# EAGLE design lamp (EAGLE 4.16)
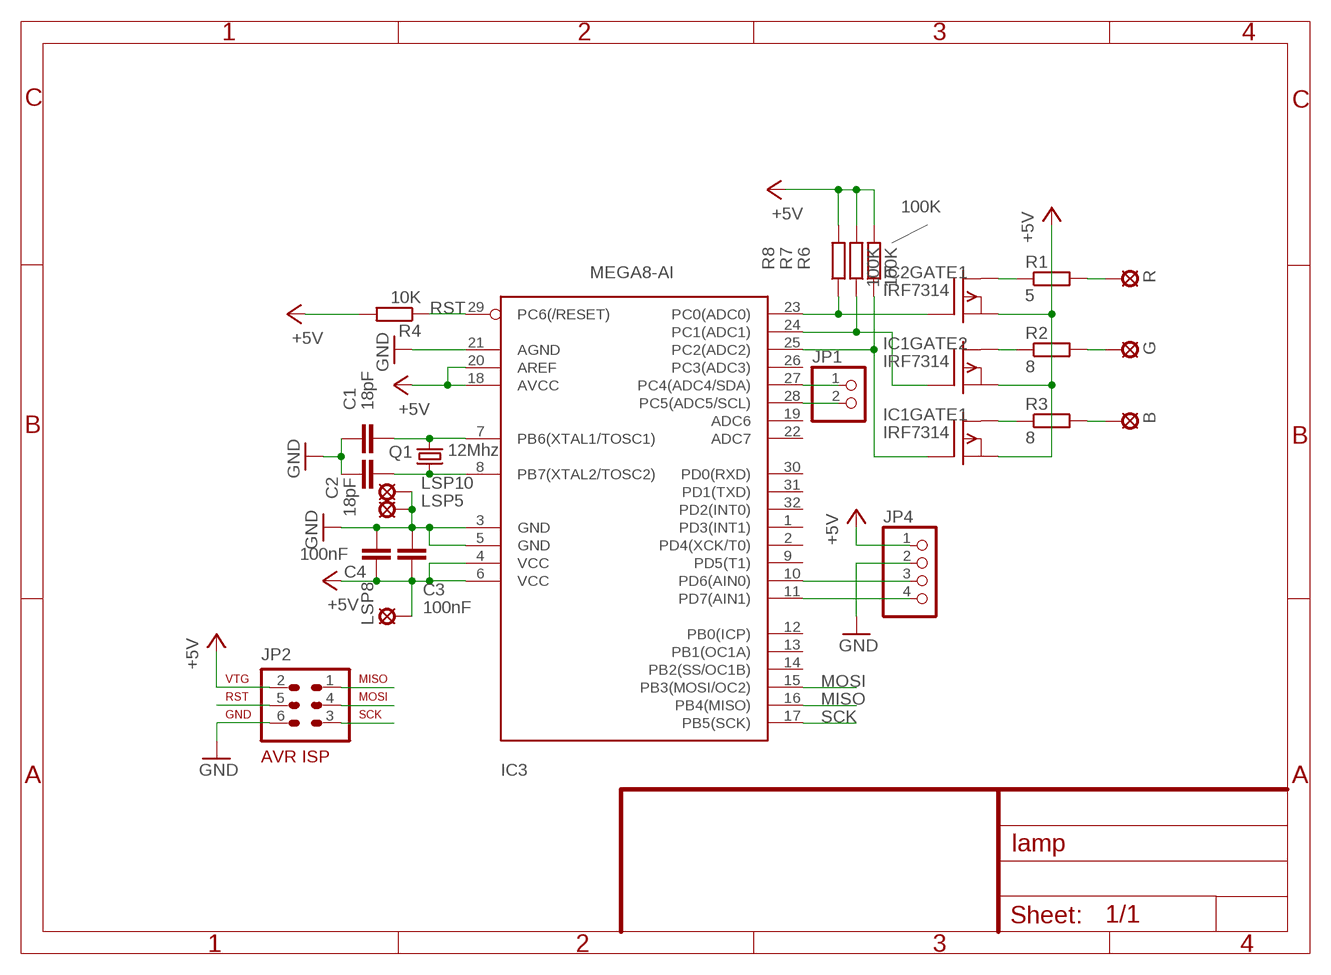
[diagram p0: schematic, sheet 1]

## Parts
B  SE14  [SE14]
C1  18pF  C-EUC0805K  [C0805K]
C2  18pF  C-EUC0805K  [C0805K]
C3  100nF  C-EUC0805K  [C0805K]
C4  100nF  C-EUC0805K  [C0805K]
G  SE14  [SE14]
IC1  IRF7314  IRF7341  [SO-8]
IC2  IRF7314  IRF7341  [SO-8]
IC3  MEGA8-AI  [TQFP32-08]
JP1  PINHD-1X2  [1X02]
JP2  AVR-ISP-6  [AVR-ISP-6]
JP4  PINHD-1X4  [1X04]
LSP5  SE14  [SE14]
LSP8  SE14  [SE14]
LSP10  SE14  [SE14]
Q1  12Mhz  CRYTALHC49S  [HC49/S]
R  SE14  [SE14]
R1  5  R-EU_0207/10  [0207/10]
R2  8  R-EU_0207/10  [0207/10]
R3  8  R-EU_0207/10  [0207/10]
R4  10K  R-EU_M0805  [M0805]
R6  100K  R-EU_M0805  [M0805]
R7  100K  R-EU_M0805  [M0805]
R8  100K  R-EU_M0805  [M0805]

## Nets
+5V: C3.1 C4.1 IC1.1(GATE1:S) IC1.3(GATE2:S) IC2.1(GATE1:S) IC3.4(VCC) IC3.6(VCC) IC3.18(AVCC) IC3.20(AREF) JP2.2 JP4.1 LSP8.MP R4.2 R6.2 R7.2 R8.2
GND: C1.1 C2.1 C3.2 C4.2 IC3.3(GND) IC3.5(GND) IC3.21(AGND) JP2.6 JP4.2 LSP5.MP LSP10.MP
MISO: IC3.16(PB4(MISO)) JP2.1
MOSI: IC3.15(PB3(MOSI/OC2)) JP2.4
N$1: IC1.7(GATE1:D1) R3.1
N$2: IC1.4(GATE2:G) IC3.24(PC1(ADC1)) R7.1
N$3: IC1.2(GATE1:G) IC3.25(PC2(ADC2)) R6.1
N$4: IC1.5(GATE2:D1) R2.1
N$5: IC2.7(GATE1:D1) R1.1
N$6: IC2.2(GATE1:G) IC3.23(PC0(ADC0)) R8.1
N$7: B.MP R3.2
N$8: G.MP R2.2
N$9: R1.2 R.MP
N$10: IC3.27(PC4(ADC4/SDA)) JP1.1
N$11: IC3.10(PD6(AIN0)) JP4.3
N$12: IC3.11(PD7(AIN1)) JP4.4
N$13: IC3.28(PC5(ADC5/SCL)) JP1.2
RST: IC3.29(PC6(/RESET)) JP2.5 R4.1
SCK: IC3.17(PB5(SCK)) JP2.3
XTAL1: C1.2 IC3.7(PB6(XTAL1/TOSC1)) Q1.2
XTAL2: C2.2 IC3.8(PB7(XTAL2/TOSC2)) Q1.1
Unconnected: IC1.6(GATE2:D) IC1.8(GATE1:D) IC2.3(GATE2:S) IC2.4(GATE2:G) IC2.5(GATE2:D1) IC2.6(GATE2:D) IC2.8(GATE1:D) IC3.1(PD3(INT1)) IC3.2(PD4(XCK/T0)) IC3.9(PD5(T1)) IC3.12(PB0(ICP)) IC3.13(PB1(OC1A)) IC3.14(PB2(SS/OC1B)) IC3.19(ADC6) IC3.22(ADC7) IC3.26(PC3(ADC3)) IC3.30(PD0(RXD)) IC3.31(PD1(TXD)) IC3.32(PD2(INT0))

## Library data of the parts
B G LSP5 LSP8 LSP10 R = solpad:SE14: SOLDER PAD E1553, drill 1,4mm, distributor Buerklin, 07F820
C1-C4 = rcl:C-EU: CAPACITOR, European symbol
IC1 IC2 = transistor-fet:IRF7341
IC3 = avr:MEGA8: MICROCONTROLLER 8 Kbytes FLASH 1 kbytes SRAM 512 bytes EEPROM USART 6-channel 10 bit ADC 2-channel 8 bit ADC
JP1 = pinhead:PINHD-1X2: PIN HEADER
JP2 = atmel:AVR-ISP-6: AVR ISP-6 Serial Programming Header
JP4 = pinhead:PINHD-1X4: PIN HEADER
Q1 = crystal:CRYTAL: CRYSTAL
R1-R4 R6-R8 = rcl:R-EU_: RESISTOR, European symbol

## Board
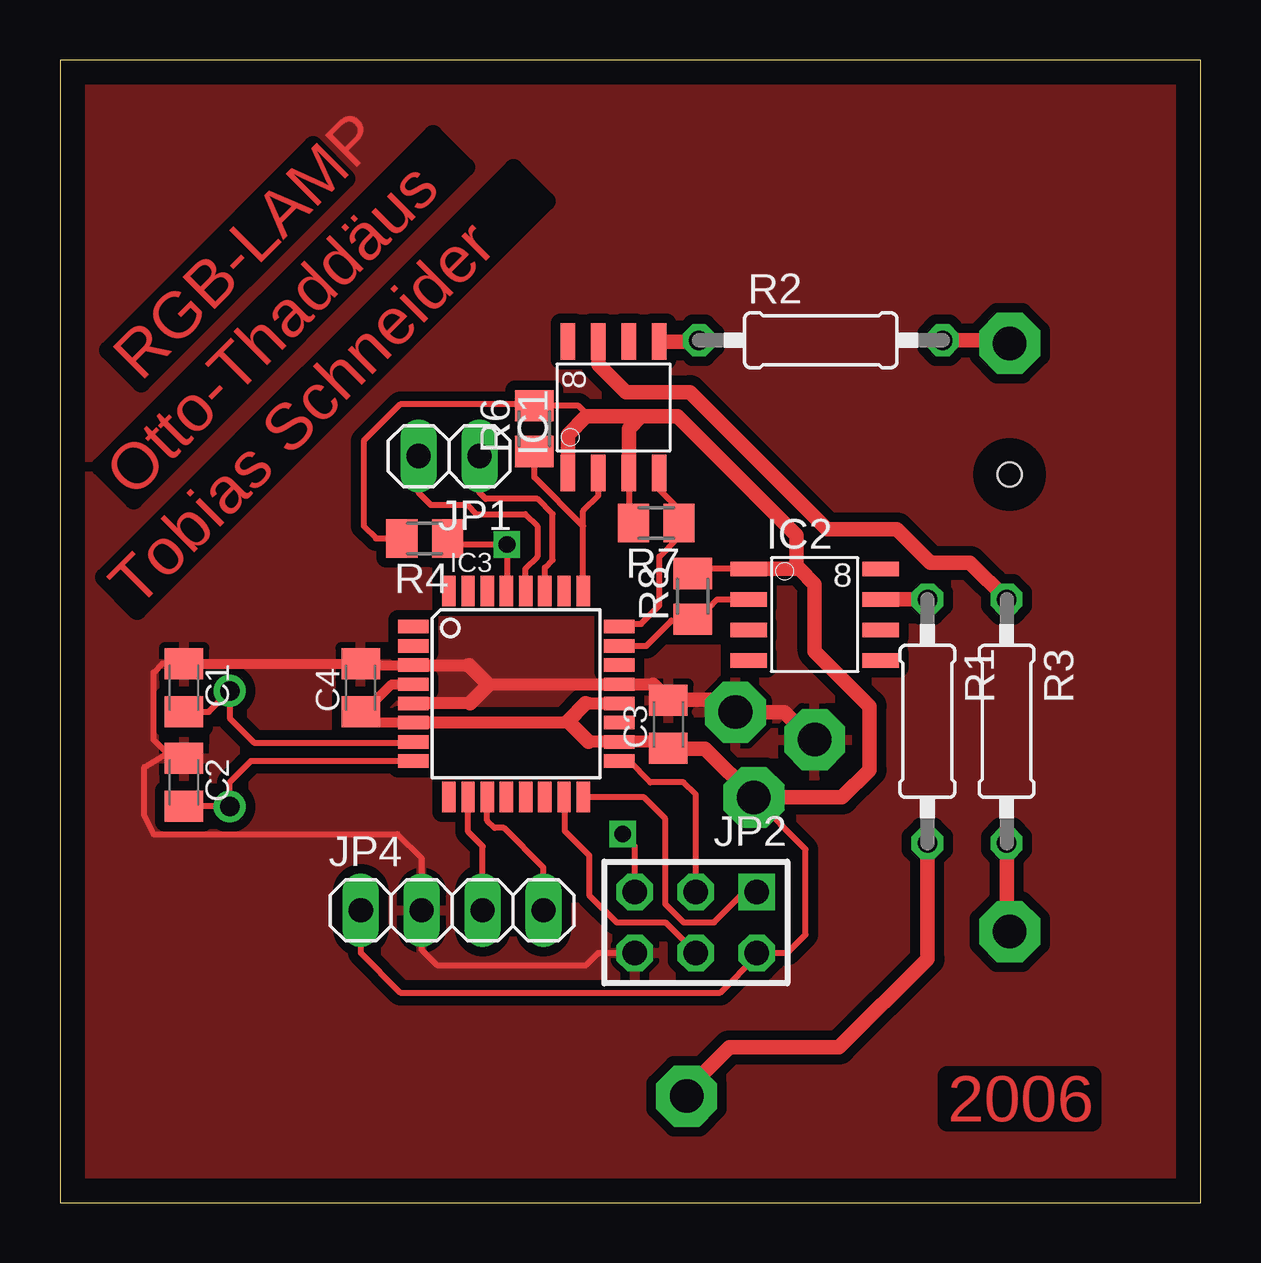
[diagram p1: board, top side]
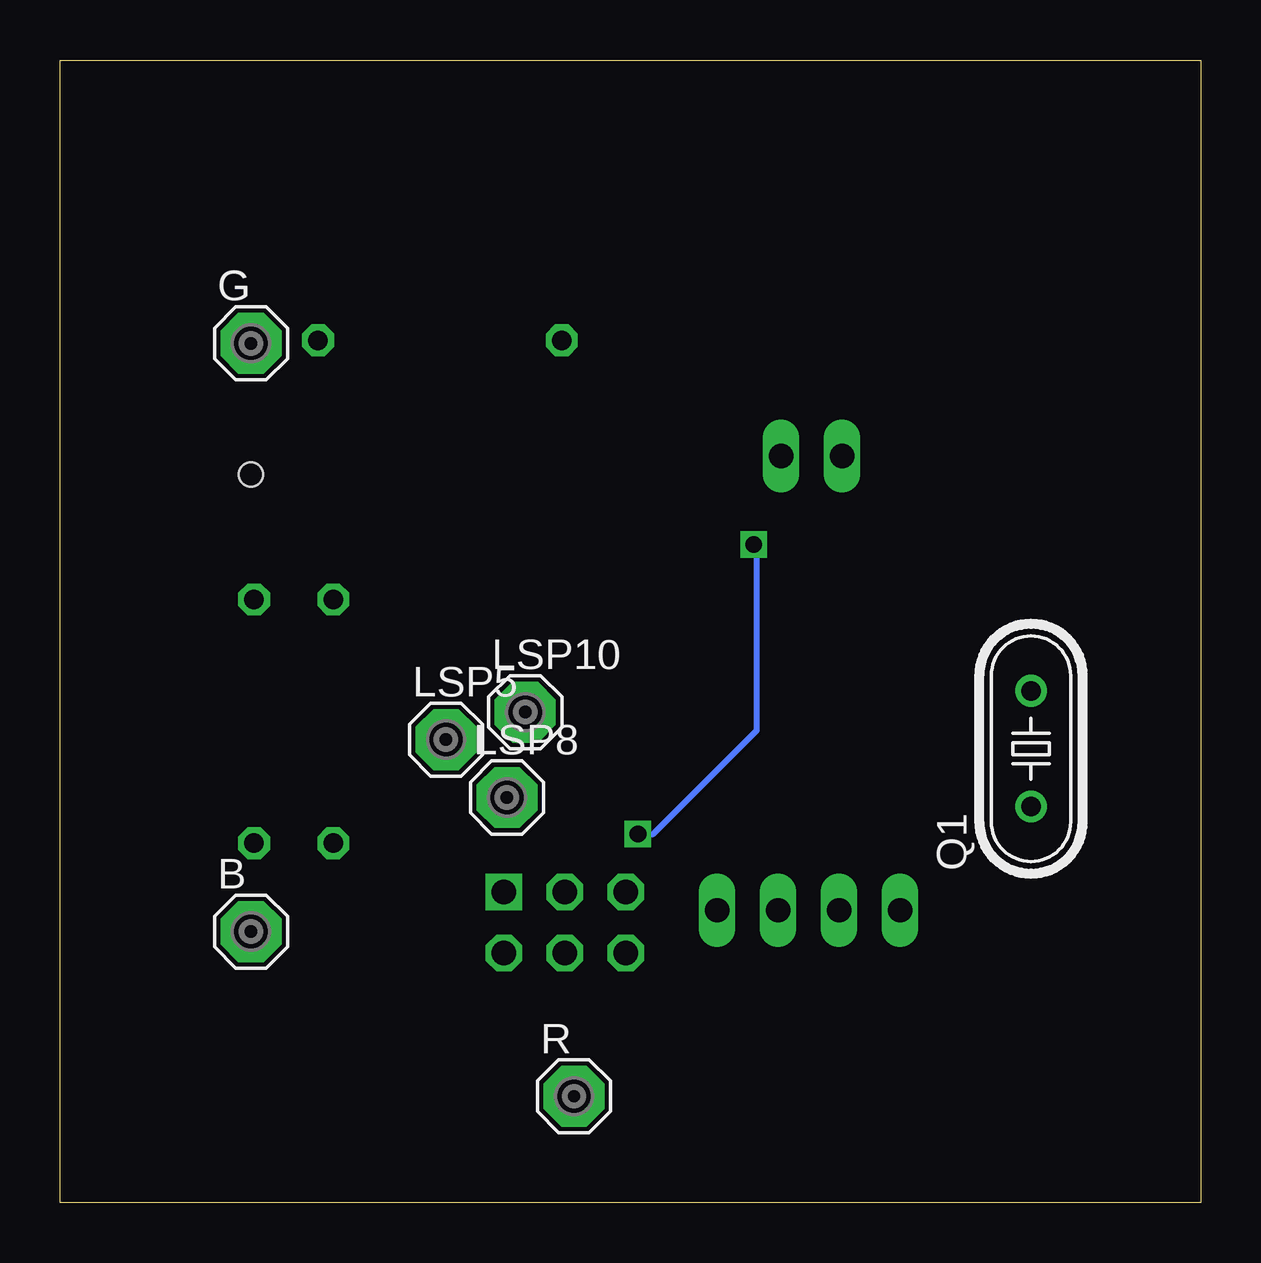
[diagram p2: board, bottom side, seen from below]

Size 47.55 x 47.62 mm. Coordinates in mm from the lower left corner, seen from the top.
Outline: 0,0 47.55,0 47.55,47.62 0,47.62 0,0
Copper layers (1*16): Top 0.035mm / dielectric 1.5mm / Bottom 0.035mm
Design rules "default": minimum track width 6mil, minimum drill 0.5mm, track to track 8mil, track to pad 8mil, pad to pad 8mil, via to via 8mil, smd to smd 8mil, copper to edge 40mil, drill to drill 8mil, minimum pad ring 10mil, minimum via ring 8mil, stop-mask expansion 4mil, vias tented up to drill 0mil, thermal gap 10mil
Holes 1 mm at 39.59,30.35

### Footprints (pad centres in the part's own frame; a part is rotated, then mirrored left to right if it is on the bottom)
SE14 = drill 1.397 pad 2.54 octagon: MP 0,0
C0805K = smd 1.3 x 1.6: 1 -1,0; 2 1,0
SO-8 = smd 1.524 x 0.61: 1 -2.743,1.27; 2 -2.743,0; 3 -2.743,-1.27; 4 -2.743,-2.54; 5 2.743,-2.54; 6 2.743,-1.27; 7 2.743,0; 8 2.743,1.27
TQFP32-08 = smd 1.27 x 0.559: 1 -4.293,2.8; 2 -4.293,2; 3 -4.293,1.2; 4 -4.293,0.4; 5 -4.293,-0.4; 6 -4.293,-1.2; 7 -4.293,-2; 8 -4.293,-2.8; 17 4.293,-2.8; 18 4.293,-2; 19 4.293,-1.2; 20 4.293,-0.4; 21 4.293,0.4; 22 4.293,1.2; 23 4.293,2; 24 4.293,2.8 | smd 0.559 x 1.27: 9 -2.8,-4.293; 10 -2,-4.293; 11 -1.2,-4.293; 12 -0.4,-4.293; 13 0.4,-4.293; 14 1.2,-4.293; 15 2,-4.293; 16 2.8,-4.293; 25 2.8,4.293; 26 2,4.293; 27 1.2,4.293; 28 0.4,4.293; 29 -0.4,4.293; 30 -1.2,4.293; 31 -2,4.293; 32 -2.8,4.293
1X02 = drill 1.016 long: 1 -1.27,0; 2 1.27,0
AVR-ISP-6 = drill 1.016 square: 1 -2.54,-1.27 | drill 1.016 octagon: 2 -2.54,1.27; 3 0,-1.27; 4 0,1.27; 5 2.54,-1.27; 6 2.54,1.27
1X04 = drill 1.016 long: 1 -3.81,0; 2 -1.27,0; 3 1.27,0; 4 3.81,0
HC49/S = drill 0.813 round: 1 -2.413,0; 2 2.413,0
0207/10 = drill 0.813 octagon: 1 -5.08,0; 2 5.08,0
M0805 = smd 1.3 x 1.6: 1 -0.95,0; 2 0.95,0

### Placement (x,y rotation side)
B  39.59,11.3 0 bottom
C1  5.17,21.46 270 top
C2  5.17,17.52 270 top
C3  25.36,19.93 90 top
C4  12.54,21.46 90 top
G  39.59,35.81 0 bottom
IC1  22.44,33.14 90 top
IC2  31.46,25.14 0 top
IC3  19.01,21.2 0 top
JP1  16.22,31.11 180 top
JP2  26.5,11.68 180 top
JP4  16.34,12.19 0 top
LSP5  31.46,19.3 0 bottom
LSP8  28.92,16.89 0 bottom
LSP10  28.16,20.44 0 bottom
Q1  7.07,18.92 90 bottom
R  26.12,4.44 0 bottom
R1  36.16,20.06 270 top
R2  31.71,35.94 0 top
R3  39.46,20.06 270 top
R4  15.2,27.68 180 top
R6  19.77,32.25 90 top
R7  24.85,28.32 180 top
R8  26.38,25.27 90 top

### Tracks (layer width: path | path; a pad name or v marks a point on that pad's centre or on a via)
+5V
  Top 0.254: 23.9,28.19 23.96,28.19 | 23.9,28.19 R7.2 23.84,28.32 | IC1.3 23.71,28.19 23.9,28.19 | LSP8.MP 31.08,14.73 31.08,11.17 30.32,10.41 JP2.2 29.04,10.28 27.52,8.76 14.19,8.76 12.54,10.41 JP4.1 | IC3.4 14.21,21.6 | R8.2 26.57,26.41 28.79,26.41 | 21.12,30.4 21.04,30.47 | IC1.1 21.12,30.4 | 21.12,30.4 21.17,30.35 | 22.06,32.76 21.62,33.2 R6.2 19.84,33.2 19.9,33.27 14.19,33.27 12.66,31.74 12.66,28.19 13.17,27.68 R4.2
  Top 0.406: IC3.4 13.82,21.6 12.66,20.44 | 12.66,20.44 12.65,20.46 C4.1 | IC3.6 13.1,20 12.66,20.44
  Top 0.508: 21.91,20.8 22.04,20.8 22.06,20.82 22.08,20.8 IC3.20 | 22.03,19.2 22.06,19.17 22.09,19.2 IC3.18 25.08,19.2 25.36,18.92 C3.1 | 21.23,20 21.24,20 | 21.24,20 IC3.6 | 21.24,20 21.3,20.06
  Top 0.61: 25.35,18.92 25.23,18.92 | 25.35,18.92 C3.1 25.36,19.17 | 25.35,18.92 25.36,18.92 26.89,18.92 LSP8.MP 32.6,16.89 33.74,18.03 33.74,20.7 31.46,22.98 31.46,25.78 30.82,26.41 30.7,26.41 | 21.91,20.8 21.17,20.06 21.23,20 22.03,19.2 | 30.7,26.41 28.79,26.41 IC2.1 | IC1.3 23.71,32.25 24.22,32.76 | IC1.1 21.17,32 21.93,32.76 22.06,32.76 24.22,32.76 | 24.22,32.76 25.74,32.76 30.7,27.81 30.7,26.41
GND
  Top 0.254: C2.1 4.68,18.52 4.47,18.73 | 4.47,18.73 3.9,19.3 3.9,22.09 4.28,22.47 5.04,22.47 5.06,22.46 C1.1 | 4.47,18.73 3.52,18.16 3.52,16.12 3.9,15.36 14.06,15.36 15.07,14.35 JP4.2 15.07,10.54 15.71,9.9 21.93,9.9 22.44,10.41 JP2.6
  Top 0.406: IC3.3 12.85,22.4 12.66,22.22 12.54,22.35 C4.2 12.65,22.46 | C1.1 12.65,22.46 | 12.65,22.46 12.66,22.47
  Top 0.508: 17.05,22.4 17.04,22.4 16.98,22.35 16.92,22.4 IC3.3 | IC3.5 14.8,20.8 14.82,20.82 14.84,20.8 17.09,20.8 | 17.8,21.65 17.76,21.6 | 17.76,21.6 IC3.21 24.71,21.6 24.85,21.46 24.85,21.45 | 17.76,21.6 17.74,21.58
  Top 0.61: 24.71,21.58 24.85,21.45 C3.2 25.36,20.95 27.65,20.95 LSP10.MP 30.19,20.44 31.46,19.17 LSP5.MP | 17.05,22.4 17.8,21.65 17.85,21.6 17.87,21.6 17.87,21.58 17.09,20.8
  pour Top (isolate 0.406): -1.82,48.51 -1.18,32 -1.18,-1.4 48.6,-1.02 50.25,49.02
MISO
  Top 0.254: JP2.1 28.54,12.95 27.27,11.68 26,11.68 25.23,12.44 25.23,16 24.35,16.89 21.81,16.89 IC3.16
MOSI
  Top 0.254: 21.04,17.01 21.01,16.98 IC3.15 21.04,16.94 21.04,17.01 | JP2.4 25.23,11.68 23.2,11.68 22.06,12.82 22.06,14.47 21.04,15.49 21.04,17.01
N$1
  Top 0.61: IC1.7 22.44,34.92 23.58,33.78 26.25,33.78 31.97,28.06 34.89,28.06 36.28,26.66 37.94,26.66 R3.1 39.59,25.01
N$2
  Top 0.254: 25.74,28.38 25.74,28.44 | 25.74,28.38 R7.1 25.74,28.32 | 25.74,28.32 25.74,27.68 24.98,26.92 24.98,24.89 24.22,24.12 23.33,24.12 23.3,24.1 IC3.24 | 25.74,28.32 25.74,28.38 | IC1.4 24.98,29.71 25.74,28.95 25.74,28.32
N$3
  Top 0.254: IC3.25 21.81,28.19 | 21.81,28.19 21.81,28.83 22.44,29.46 IC1.2 22.44,30.6 | 21.81,28.19 19.77,30.22 R6.1
N$4
  Top 0.61: IC1.5 26.63,35.89 R2.1
N$5
  Top 0.61: 36.28,25.14 R1.1 IC2.7
N$6
  Top 0.254: IC3.23 24.44,23.2 25.49,24.25 26.25,24.25 26.38,24.38 R8.1 26.82,24.76 27.01,24.76 27.39,25.14 IC2.2
N$7
  Top 0.61: B.MP 39.59,10.79 39.46,10.92 R3.2
N$8
  Top 0.61: G.MP 39.59,35.68 39.33,35.94 R2.2
N$9
  Top 0.61: R1.2 36.16,10.16 32.47,6.47 27.9,6.47 26.12,4.69 R.MP
N$10
  Top 0.254: IC3.27 20.21,26.47 20.54,26.79 20.54,28.7 19.9,29.33 17.74,29.33 17.49,29.59 JP1.1
N$11
  Top 0.254: IC3.10 17.01,15.46 17.61,14.85 JP4.3 17.61,12.06
N$12
  Top 0.254: IC3.11 17.81,15.93 18.12,15.62 18.5,15.62 20.16,13.96 JP4.4
N$13
  Top 0.254: IC3.28 19.39,25.5 19.39,26.41 19.9,26.92 19.9,28.19 19.39,28.7 17.36,28.7 16.98,29.08 15.46,29.08 14.95,29.59 JP1.2
RST  (via drill 0.7)
  Top 0.254: 18.63,25.27 18.63,25.48 IC3.29 18.63,25.52 v18.63,27.43 16.41,27.43 R4.1 | JP2.5 23.96,14.85 v23.46,15.36
  Bottom 0.254: v18.63,27.43 18.5,27.43 18.5,19.68 22.82,15.36 v23.46,15.36
SCK
  Top 0.254: 23.46,18.41 23.33,18.28 23.3,18.31 IC3.17 23.7,18.4 23.71,18.41 24.6,17.52 26,17.52 26.5,17.01 JP2.3
XTAL1
  Top 0.254: IC3.7 14.69,19.17 8.09,19.17 7.07,20.19 Q1.2 6.2,20.46 C1.2
XTAL2
  Top 0.254: IC3.8 14.81,18.4 14.82,18.41 7.96,18.41 7.07,17.52 Q1.1 7.06,16.52 C2.2

### Text on the board
Top: RGB-LAMP | Otto-Thaddäus | Tobias Schneider | 2006